# Altium schematic sheet GralAscii.SchDoc
size A4
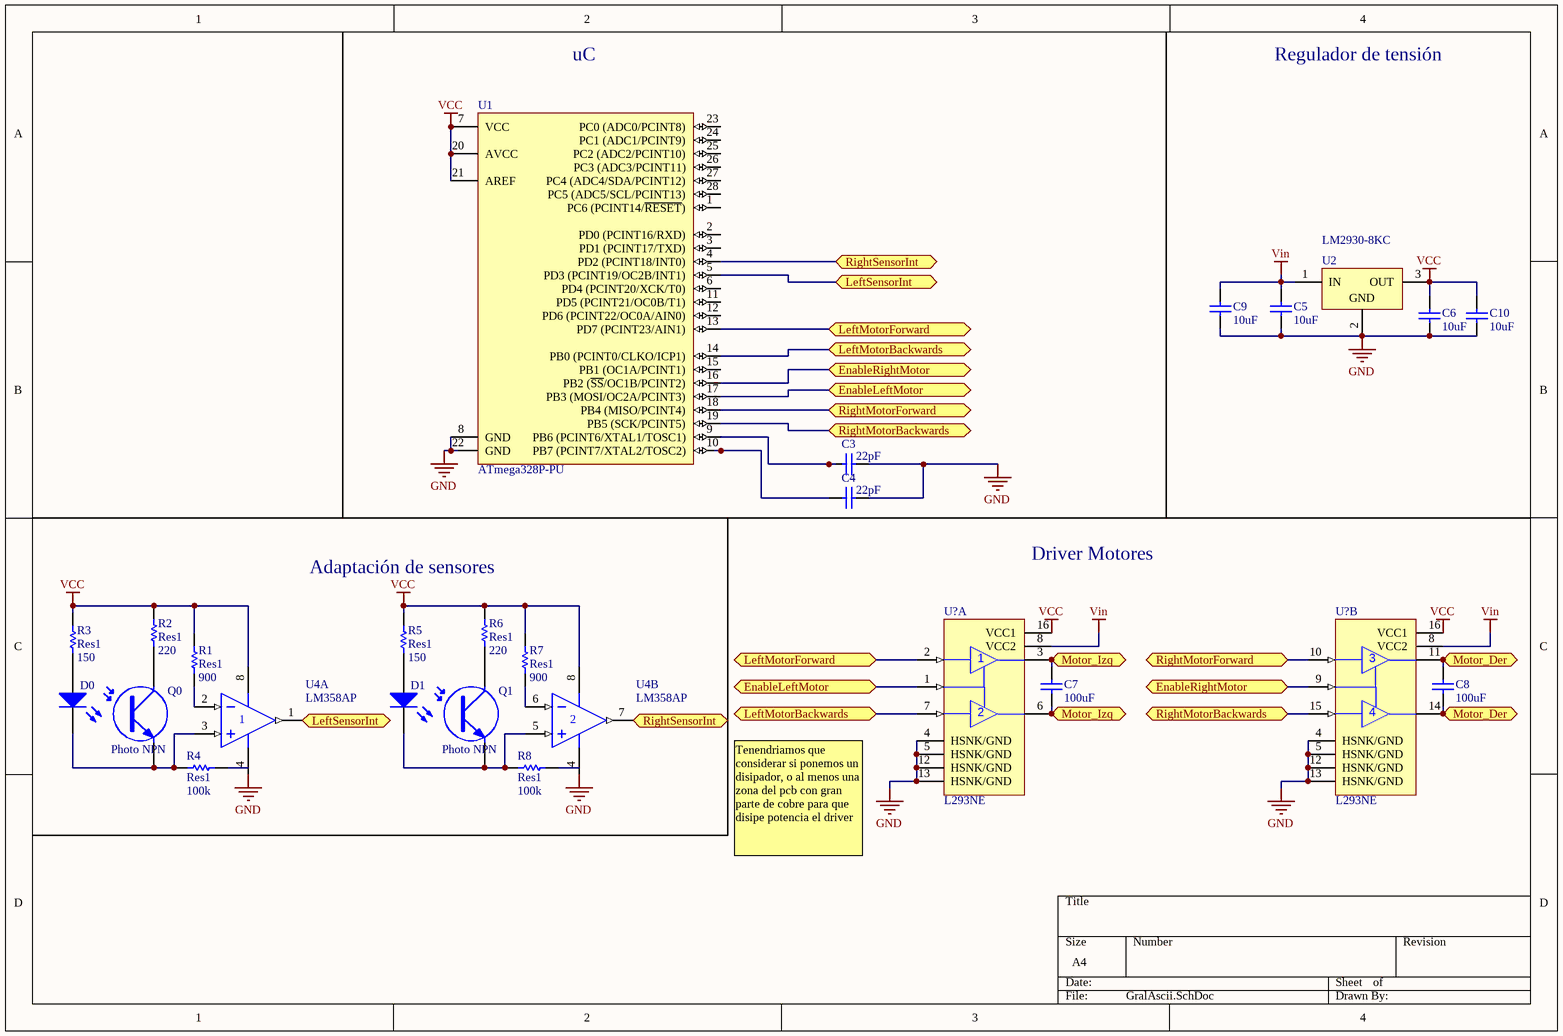
[diagram p0: GralAscii.SchDoc]

## Parts
(Parts that share a designator on the sheet are numbered #1, #2 ... from top to bottom, then left to right.)
C3  value 22pF  [RAD-0.3]  (hidden comment: Cap)
C4  value 22pF  [RAD-0.3]  (hidden comment: Cap)
C5  value 10uF  [RAD-0.3]  (hidden comment: Cap)
C6  value 10uF  [RAD-0.3]  (hidden comment: Cap)
C7  value 100uF  [RAD-0.3]  (hidden comment: Cap)
C8  value 100uF  [RAD-0.3]  (hidden comment: Cap)
C9  value 10uF  [RAD-0.3]  (hidden comment: Cap)
C10  value 10uF  [RAD-0.3]  (hidden comment: Cap)
D0  (no value)  [LED-0]
D1  (no value)  [LED-0]
Q0  Photo NPN  [TO-220_A]
Q1  Photo NPN  [TO-220_A]
R1  Res1  value 900  [AXIAL-0.3]
R2  Res1  value 220  [AXIAL-0.3]
R3  Res1  value 150  [AXIAL-0.3]
R4  Res1  value 100k  [AXIAL-0.3]
R5  Res1  value 150  [AXIAL-0.3]
R6  Res1  value 220  [AXIAL-0.3]
R7  Res1  value 900  [AXIAL-0.3]
R8  Res1  value 100k  [AXIAL-0.3]
U1  ATmega328P-PU  [28P3]
U2  LM2930-8KC  [KC03]
U4  LM358AP  [P008]  (parts A,B of 2)
U?#1  L293NE  [NE016]  (part A of 2)
U?#2  L293NE  [NE016]  (part B of 2)

## Ports
EnableLeftMotor, EnableRightMotor, LeftMotorBackwards, LeftMotorForward, LeftSensorInt, Motor_Der, Motor_Izq, RightMotorBackwards, RightMotorForward, RightSensorInt

## Nets
GND: C3.2 C4.2 C5.1 C6.1 C9.1 C10.1 U1.8(GND) U1.22(GND) U2.2(GND) U4.4(V-) U?#1.4(HSNK/GND) U?#1.5(HSNK/GND) U?#1.12(HSNK/GND) U?#1.13(HSNK/GND) U?#2.4(HSNK/GND) U?#2.5(HSNK/GND) U?#2.12(HSNK/GND) U?#2.13(HSNK/GND)
VCC: C6.2 C10.2 R1.2 R2.2 R3.2 R5.2 R6.2 R7.2 U1.7(VCC) U1.20(AVCC) U1.21(AREF) U2.3(OUT) U4.8(V+) U?#1.16(VCC1) U?#2.16(VCC1)
Vin: C5.2 C9.2 U2.1(IN) U?#1.8(VCC2) U?#2.8(VCC2)
EnableLeftMotor: U1.17(PB3_(MOSI/OC2A/PCINT3)) U?#1.1(1,2EN) ; port EnableLeftMotor
EnableRightMotor: U1.16(PB2_(~{SS}/OC1B/PCINT2)) U?#2.9(3,4EN) ; port EnableRightMotor
LeftMotorBackwards: U1.14(PB0_(PCINT0/CLKO/ICP1)) U?#1.7(2A) ; port LeftMotorBackwards
LeftMotorForward: U1.13(PD7_(PCINT23/AIN1)) U?#1.2(1A) ; port LeftMotorForward
LeftSensorInt: U1.5(PD3_(PCINT19/OC2B/INT1)) U4.1(OUT) ; port LeftSensorInt
Motor_Der: C8.1 C8.2 U?#2.11(3Y) U?#2.14(4Y) ; port Motor_Der
Motor_Izq: C7.1 C7.2 U?#1.3(1Y) U?#1.6(2Y) ; port Motor_Izq
RightMotorBackwards: U1.19(PB5_(SCK/PCINT5)) U?#2.15(4A) ; port RightMotorBackwards
RightMotorForward: U1.18(PB4_(MISO/PCINT4)) U?#2.10(3A) ; port RightMotorForward
RightSensorInt: U1.4(PD2_(PCINT18/INT0)) U4.7(OUT) ; port RightSensorInt
NetC3_1: C3.1 U1.9(PB6_(PCINT6/XTAL1/TOSC1))
NetC4_1: C4.1 U1.10(PB7_(PCINT7/XTAL2/TOSC2))
NetD0_1: D0.1(A) R3.1
NetD0_2: D0.2(K) Q0.3(E) R4.1 U4.3(IN+)
NetD1_1: D1.1(A) R5.1
NetD1_2: D1.2(K) Q1.3(E) R8.1 U4.5(IN+)
NetQ0_1: Q0.1(C) R2.1
NetQ1_1: Q1.1(C) R6.1
NetR1_1: R1.1 U4.2(IN-)
NetR7_1: R7.1 U4.6(IN-)

Not connected (* = marked no-connect by the designer): R4 2; R8 2; U1 1(PC6_(PCINT14/~{RESET})) 2(PD0_(PCINT16/RXD)) 3(PD1_(PCINT17/TXD)) 6(PD4_(PCINT20/XCK/T0)) 11(PD5_(PCINT21/OC0B/T1)) 12(PD6_(PCINT22/OC0A/AIN0)) 15(PB1_(OC1A/PCINT1)) 23(PC0_(ADC0/PCINT8)) 24(PC1_(ADC1/PCINT9)) 25(PC2_(ADC2/PCINT10)) 26(PC3_(ADC3/PCINT11)) 27(PC4_(ADC4/SDA/PCINT12)) 28(PC5_(ADC5/SCL/PCINT13))

## Notes on the sheet
- uC
- Regulador de tensión
- Adaptación de sensores
- Driver Motores
- Tenendriamos que considerar si ponemos un disipador, o al menos una zona del pcb con gran parte de cobre para que disipe potencia el driver

## Library data of the parts
C3-C10 = Cap: Capacitor; Published: 8-Jun-2000; LatestRevisionDate: 17-Jul-2002; LatestRevisionNote: Re-released for DXP Platform.; PackageReference: RAD-0.3; Publisher: Altium Limited; PackageDescription: Radial Cap, Thru-Hole; 2 Leads; 0.3 in Pin Spacing
D0 D1 = LED0: Typical INFRARED GaAs LED; Published: 8-Jun-2000; LatestRevisionDate: 08-Jul-2005; LatestRevisionNote: Mech Layer 1 removed.; PackageReference: LED-0; Publisher: Altium Limited; PackageDescription: LED; 2 Leads
Q0 Q1 = Photo NPN: NPN Phototransistor; Published: 24-Mar-1999; LatestRevisionDate: 17-Jul-2002; LatestRevisionNote: Re-released for DXP Platform.; PackageReference: TO-220_A; Publisher: Altium Limited; Code_JEDEC: TO-220-AC
R1-R8 = Res1: Resistor; Published: 8-Jun-2000; LatestRevisionDate: 17-Jul-2002; LatestRevisionNote: Re-released for DXP Platform.; PackageReference: AXIAL-0.3; Publisher: Altium Limited; PackageDescription: Axial Device, Thru-Hole; 2 Leads; 0.3 in Pin Spacing
U1 = ATmega328P-PU: 8-bit AVR Microcontroller, 32KB Flash, 1KB EEPROM, 2KB SRAM, 28-pin PDIP, Industrial Grade (-40°C to 85°C); Published: 1-Apr-2010; DatasheetVersion: revA, Jan-2010; PackageVersion: revB, Sep-2001; PackageReference: 28P3; Publisher: Altium Limited; PackageDescription: 28-lead (0.300"/7.62mm Wide) Plastic Dual Inline Package (PDIP); Supplier 1: Digi-Key; Supplier Part Number 1: ATMEGA328P-PU-ND; Supplier 2: Farnell; Supplier Part Number 2: 1715487; Supplier 3: Mouser; Supplier Part Number 3: 556-ATMEGA328P-PU; ComponentLink1Description: Manufacturer Link; ComponentLink1URL: http://www.atmel.com/products/avr/default.asp?; ComponentLink2Description: ATmega48A/48PA/88A/88PA/168A/168PA/328/328P Datasheet; ComponentLink2URL: http://www.atmel.com/dyn/resources/prod_documents/8271.pdf; ComponentLink3Description: ATmega48A/48PA/88A/88PA/168A/168PA/328/328P Summary; ComponentLink3URL: http://www.atmel.com/dyn/resources/prod_documents/8271S.pdf; ComponentLink4Description: Atmel.com Home; ComponentLink4URL: http://www.atmel.com
U2 = LM2930-8KC: 3-Terminal Positive Regulator; Note: Pin 2 is electrically connected to tab; Published: 15-Apr-2002; DatasheetVersion: Jun-1988; PackageVersion: Sep-1995; PackageReference: KC03; Publisher: Altium Limited; PackageDescription: TO, Thru-Hole, Vertical, Heatsink Mounted; 3 In-Line Leads; Pitch 2.54 mm; ComponentLink1Description: Manufacturer Link; ComponentLink1URL: http://www.ti.com/
U4 = LM358AP: Dual Operational Amplifier; Published: 15-Apr-2002; LatestRevisionDate: 04-Mar-2005; LatestRevisionNote: Stylized 3D Model Added.; DatasheetVersion: Aug-1988; PackageVersion: Jun-1999; PackageReference: P008; Publisher: Altium Limited; PackageDescription: DIP; 8 Leads; Row Spacing 7.62 mm; Pitch 2.54 mm; Code_JEDEC: MO-001-AN; ComponentLink1Description: Manufacturer Link; ComponentLink1URL: http://www.ti.com/; ComponentLink2Description: Datasheet; ComponentLink2URL: http://www-s.ti.com/sc/ds/lm358.pdf
U?#1 U?#2 = L293NE: Quadruple Half-H Driver; Published: 15-May-2002; LatestRevisionDate: 29-May-2009; LatestRevisionNote: Component Body Added.; DatasheetVersion: May-1990; PackageVersion: 1991; PackageReference: NE016; Publisher: Altium Limited; PackageDescription: DIP, 16-Pin, Row Spacing 7.62 mm, Pitch 2.54 mm; Code_JEDEC: MS-001-BB; ComponentLink1Description: Manufacturer Link; ComponentLink1URL: http://www.ti.com/; ComponentLink2Description: Datasheet; ComponentLink2URL: http://www-s.ti.com/sc/ds/l293.pdf